# Altium schematic sheet Top_Level_Test.SchDoc
size 381 x 381 mm
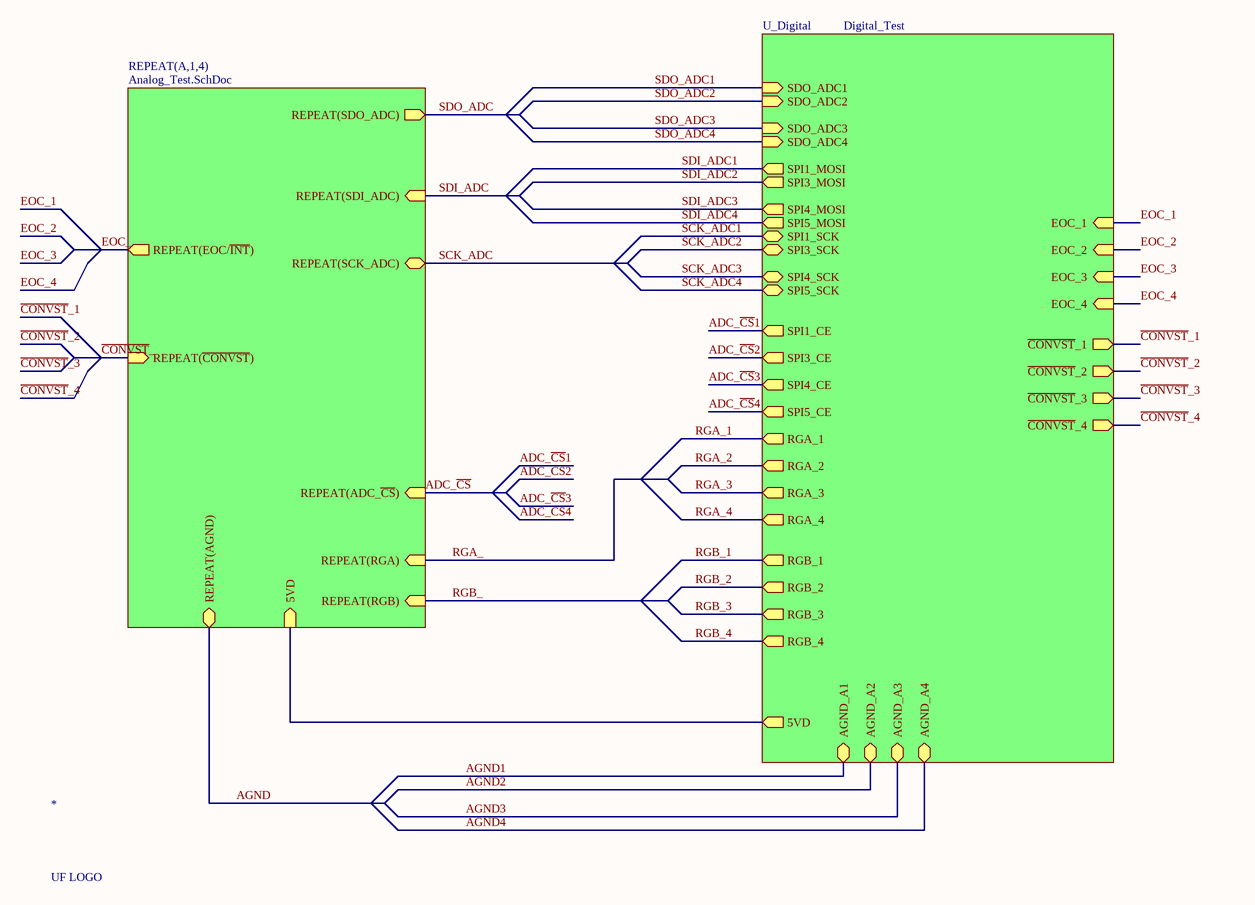
[diagram p0: Top_Level_Test.SchDoc]

## Parts
*  UF LOGO  [UF LOGO-1000]
MIL  MIL LOGO  [MIL LOGO - 500]  (value not drawn)

## Sub-sheets
REPEAT(A,1,4) = Analog_Test.SchDoc: REPEAT(SCK_ADC) (bidir), REPEAT(SDO_ADC) (out), REPEAT(SDI_ADC) (in), REPEAT(ADC_~{CS}) (in), REPEAT(EOC/~{INT}) (out), REPEAT(~{CONVST}) (in), 5VD (in), REPEAT(AGND) (bidir), REPEAT(RGA) (in), REPEAT(RGB) (in)
U_Digital = Digital_Test: SPI1_SCK (bidir), SPI3_SCK (bidir), SPI4_SCK (bidir), SPI5_SCK (bidir), SDO_ADC1 (in), SPI1_MOSI (out), SDO_ADC2 (in), SPI3_MOSI (out), SDO_ADC3 (in), SPI4_MOSI (out), SDO_ADC4 (in), SPI5_MOSI (out), SPI1_CE (out), SPI3_CE (out), SPI4_CE (out), SPI5_CE (out), AGND_A1 (bidir), AGND_A2 (bidir), AGND_A3 (bidir), AGND_A4 (bidir), RGA_1 (out), RGA_2 (out), RGB_1 (out), RGB_2 (out), RGA_3 (out), RGA_4 (out), RGB_3 (out), RGB_4 (out), EOC_1 (in), ~{CONVST}_1 (out), EOC_2 (in), EOC_3 (in), EOC_4 (in), ~{CONVST}_2 (out), ~{CONVST}_3 (out), ~{CONVST}_4 (out), 5VD (out)

## Nets
ADC_~{CS}: sheet REPEAT(A,1,4)/REPEAT(ADC_~{CS})
ADC_~{CS}1: sheet U_Digital/SPI1_CE
ADC_~{CS}2: sheet U_Digital/SPI3_CE
ADC_~{CS}3: sheet U_Digital/SPI4_CE
ADC_~{CS}4: sheet U_Digital/SPI5_CE
AGND: sheet REPEAT(A,1,4)/REPEAT(AGND)
AGND1: sheet U_Digital/AGND_A1
AGND2: sheet U_Digital/AGND_A2
AGND3: sheet U_Digital/AGND_A3
AGND4: sheet U_Digital/AGND_A4
~{CONVST}_: sheet REPEAT(A,1,4)/REPEAT(~{CONVST})
~{CONVST}_1: sheet U_Digital/~{CONVST}_1
~{CONVST}_2: sheet U_Digital/~{CONVST}_2
~{CONVST}_3: sheet U_Digital/~{CONVST}_3
~{CONVST}_4: sheet U_Digital/~{CONVST}_4
EOC_: sheet REPEAT(A,1,4)/REPEAT(EOC/~{INT})
EOC_1: sheet U_Digital/EOC_1
EOC_2: sheet U_Digital/EOC_2
EOC_3: sheet U_Digital/EOC_3
EOC_4: sheet U_Digital/EOC_4
RGA_: sheet REPEAT(A,1,4)/REPEAT(RGA)
RGA_1: sheet U_Digital/RGA_1
RGA_2: sheet U_Digital/RGA_2
RGA_3: sheet U_Digital/RGA_3
RGA_4: sheet U_Digital/RGA_4
RGB_: sheet REPEAT(A,1,4)/REPEAT(RGB)
RGB_1: sheet U_Digital/RGB_1
RGB_2: sheet U_Digital/RGB_2
RGB_3: sheet U_Digital/RGB_3
RGB_4: sheet U_Digital/RGB_4
SCK_ADC: sheet REPEAT(A,1,4)/REPEAT(SCK_ADC)
SCK_ADC1: sheet U_Digital/SPI1_SCK
SCK_ADC2: sheet U_Digital/SPI3_SCK
SCK_ADC3: sheet U_Digital/SPI4_SCK
SCK_ADC4: sheet U_Digital/SPI5_SCK
SDI_ADC: sheet REPEAT(A,1,4)/REPEAT(SDI_ADC)
SDI_ADC1: sheet U_Digital/SPI1_MOSI
SDI_ADC2: sheet U_Digital/SPI3_MOSI
SDI_ADC3: sheet U_Digital/SPI4_MOSI
SDI_ADC4: sheet U_Digital/SPI5_MOSI
SDO_ADC: sheet REPEAT(A,1,4)/REPEAT(SDO_ADC)
SDO_ADC1: sheet U_Digital/SDO_ADC1
SDO_ADC2: sheet U_Digital/SDO_ADC2
SDO_ADC3: sheet U_Digital/SDO_ADC3
SDO_ADC4: sheet U_Digital/SDO_ADC4
(unnamed): sheet REPEAT(A,1,4)/5VD, sheet U_Digital/5VD